# Altium schematic sheet ATRACK_PILOT_V1.SchDoc
size A4
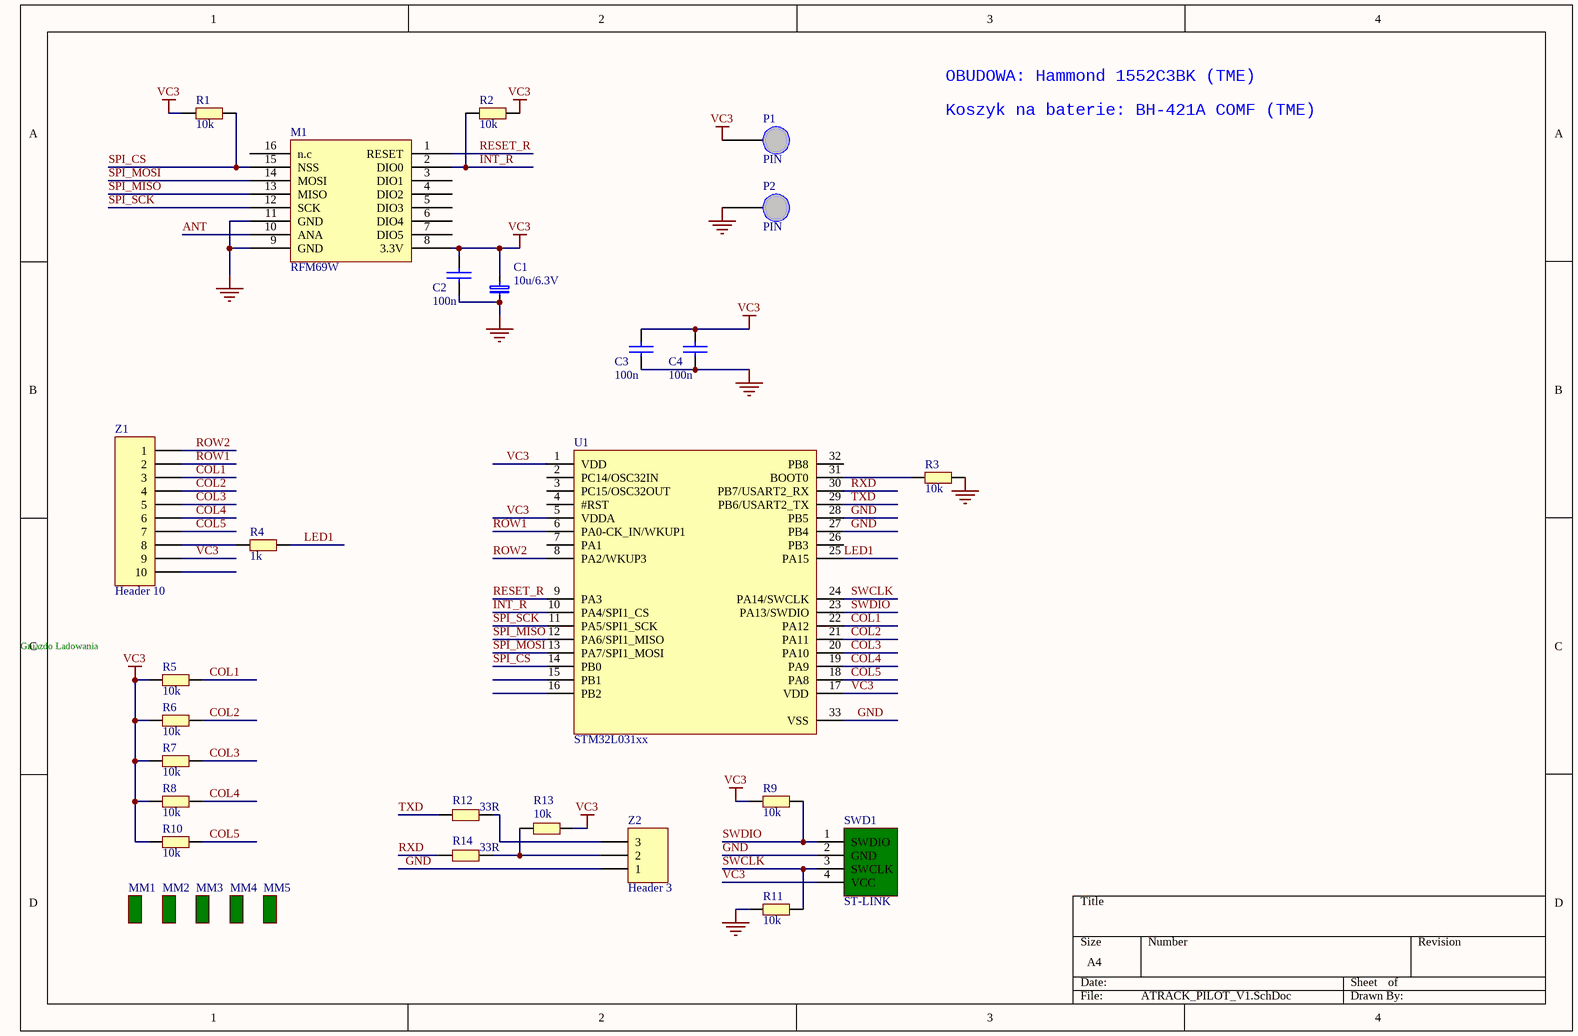
[diagram p0: ATRACK_PILOT_V1.SchDoc]

## Parts
C1  10u/6.3V  [CAP_A]
C2  100n  [0603C]
C3  100n  [0603C]
C4  100n  [0603C]
M1  RFM69W  [RFM69W]
MM1  (no value)  [REF_CIR]
MM2  (no value)  [REF_CIR]
MM3  (no value)  [REF_SQR]
MM4  (no value)  [REF_SQR]
MM5  (no value)  [PB_FREE_GRAF]
P1  PIN  [PP_PICO6]
P2  PIN  [PP_PICO6]
R1  10k  [0603R]
R2  10k  [0603R]
R3  10k  [0603R]
R4  1k  [0603R]
R5  10k  [0603R]
R6  10k  [0603R]
R7  10k  [0603R]
R8  10k  [0603R]
R9  10k  [0603R]
R10  10k  [0603R]
R11  10k  [0603R]
R12  33R  [0603R]
R13  10k  [0603R]
R14  33R  [0603R]
SWD1  ST-LINK  [PIN4]
U1  STM32L031xx  [UFQFPN32]
Z1  Header 10  [MX-52271-2079]
Z2  Header 3  [PIN3]

## Nets
GND: C1.1 C2.1 C3.1 C4.1 M1.9(GND) M1.11(GND) P2.1 R3.1 R11.1 SWD1.2(GND) U1.27(PB4) U1.28(PB5) U1.33(VSS) Z2.1
VC3: C1.2 C2.2 C3.2 C4.2 M1.8(3.3V) P1.1 R1.2 R2.1 R5.1 R6.1 R7.1 R8.1 R9.1 R10.1 R13.2 SWD1.4(VCC) U1.1(VDD) U1.5(VDDA) U1.17(VDD) Z1.9
ANT: M1.10(ANA)
COL1: R5.2 U1.22(PA12) Z1.3
COL2: R6.2 U1.21(PA11) Z1.4
COL3: R7.2 U1.20(PA10) Z1.5
COL4: R8.2 U1.19(PA9) Z1.6
COL5: R10.2 U1.18(PA8) Z1.7
INT_R: M1.2(DIO0) R2.2 U1.10(PA4/SPI1_CS)
LED1: R4.1 U1.25(PA15)
RESET_R: M1.1(RESET) U1.9(PA3)
ROW1: U1.6(PA0-CK_IN/WKUP1) Z1.2
ROW2: U1.8(PA2/WKUP3) Z1.1
RXD: R14.2 U1.30(PB7/USART2_RX)
SPI_CS: M1.15(NSS) R1.1 U1.14(PB0)
SPI_MISO: M1.13(MISO) U1.12(PA6/SPI1_MISO)
SPI_MOSI: M1.14(MOSI) U1.13(PA7/SPI1_MOSI)
SPI_SCK: M1.12(SCK) U1.11(PA5/SPI1_SCK)
SWCLK: R11.2 SWD1.3(SWCLK) U1.24(PA14/SWCLK)
SWDIO: R9.2 SWD1.1(SWDIO) U1.23(PA13/SWDIO)
TXD: R12.2 U1.29(PB6/USART2_TX)
NetR3_2: R3.2 U1.31(BOOT0)
NetR4_2: R4.2 Z1.8
NetR12_1: R12.1 Z2.3
NetR13_1: R13.1 R14.1 Z2.2

Not connected (* = marked no-connect by the designer): M1 3(DIO1) 4(DIO2) 5(DIO3) 6(DIO4) 7(DIO5) 16(n.c); U1 2(PC14/OSC32IN) 3(PC15/OSC32OUT) 4(#RST) 7(PA1) 15(PB1) 16(PB2) 26(PB3) 32(PB8); Z1 10

## Notes on the sheet
- OBUDOWA: Hammond 1552C3BK (TME)
- Koszyk na baterie: BH-421A COMF (TME)
- Gniazdo Ladowania

## Library data of the parts
C1 = CAP_TANTAL_SMD: KONDENSATOR ELEKTROLITYCZNY TANTALOWY SMD
C2-C4 = CAP: Capacitor
M1 = RFM96W
MM1-MM5 = MECH
R1-R14 = RES3
SWD1 = SW_CON: Header, 4-Pin; LatestRevisionDate: 17-Jul-2002; LatestRevisionNote: Re-released for DXP Platform.; Publisher: Altium Limited
U1 = STM32L031xx/UFQFPN32
Z1 = Header 10: Header, 10-Pin; LatestRevisionDate: 17-Jul-2002; LatestRevisionNote: Re-released for DXP Platform.; Publisher: Altium Limited
Z2 = Header 3: Header, 3-Pin; LatestRevisionDate: 17-Jul-2002; LatestRevisionNote: Re-released for DXP Platform.; Publisher: Altium Limited